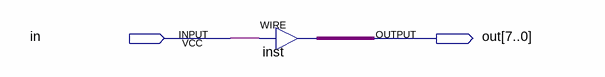
[diagram p0: schematic sheet]
// Quartus schematic replicate8.bdf as structural Verilog: 1 symbols, 2 pins
module replicate8 (
  input  in,
  output [7:0] out
);

  assign out = {8{in}};  // WIRE inst
endmodule
